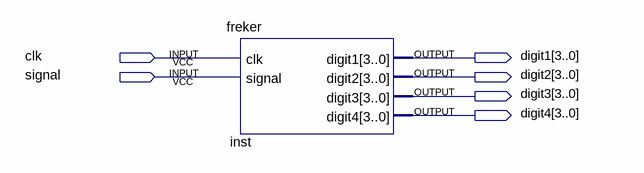
[diagram p0: schematic sheet]
// Quartus schematic Block3.bdf as structural Verilog: 1 symbols, 6 pins
module Block3 (
  input  clk,
  input  signal,
  output [3:0] digit1,
  output [3:0] digit2,
  output [3:0] digit3,
  output [3:0] digit4
);

  freker inst (.clk(clk), .signal(signal), .digit1(digit1), .digit2(digit2), .digit3(digit3), .digit4(digit4));
endmodule
